# EAGLE design Buggsy Girrafe (EAGLE 7.7.0)
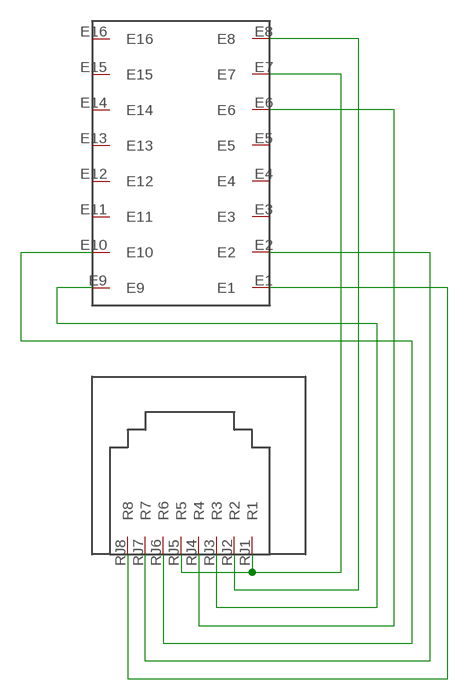
[diagram p0: schematic, sheet 1]

## Parts
U$1  BUGGSY  [RJ45]

## Nets
N$1: U$1.E7 U$1.RJ1(R1) U$1.RJ5(R5)
N$2: U$1.E8 U$1.RJ2(R2)
N$3: U$1.E9 U$1.RJ3(R3)
N$4: U$1.E6 U$1.RJ4(R4)
N$5: U$1.E10 U$1.RJ6(R6)
N$6: U$1.E2 U$1.RJ7(R7)
N$7: U$1.E1 U$1.RJ8(R8)
Unconnected: U$1.E3 U$1.E4 U$1.E5 U$1.E11 U$1.E12 U$1.E13 U$1.E14 U$1.E15 U$1.E16

## Library data of the parts
U$1 = Bugsy:BUGGSY

## Board
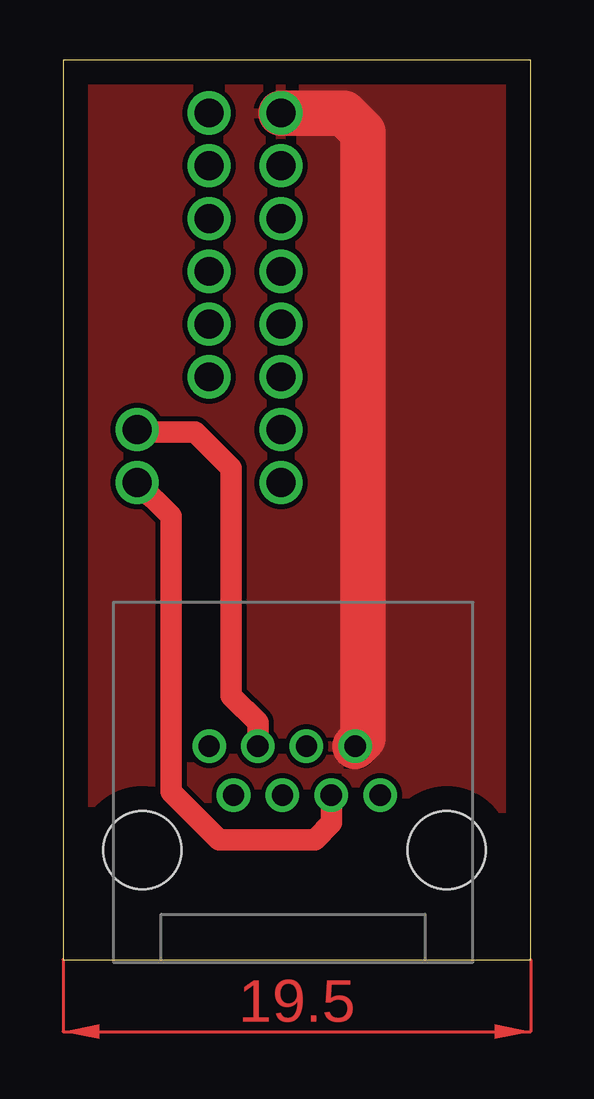
[diagram p1: board, top side]
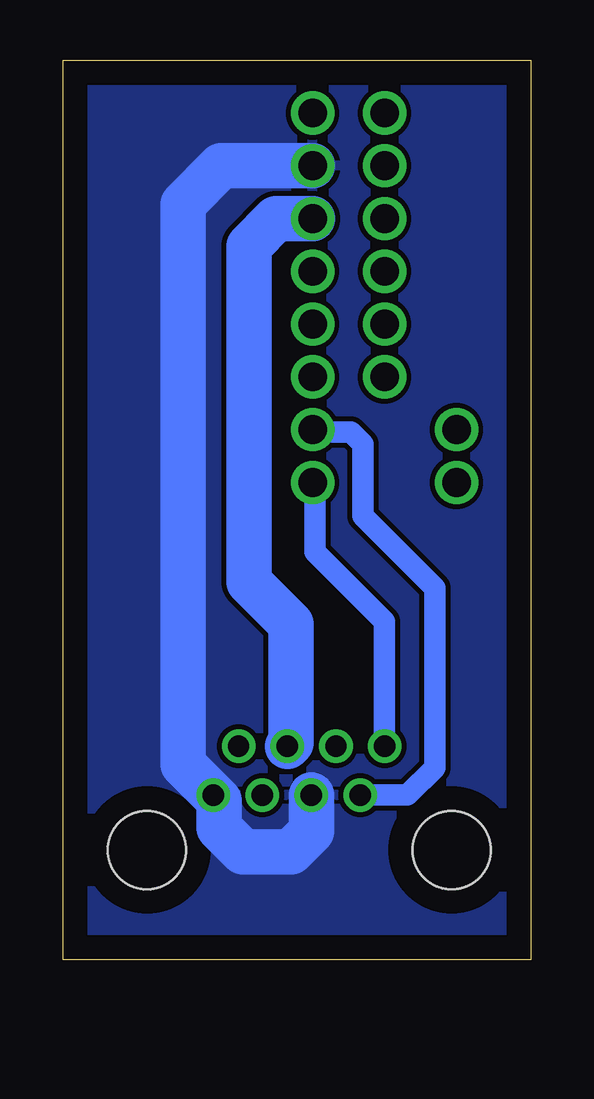
[diagram p2: board, bottom side, seen from below]

Size 19.5 x 37.5 mm. Coordinates in mm from the lower left corner, seen from the top.
Outline: 0,0 19.5,0 19.5,37.5 0,37.5 0,0
Copper layers (1*16): Top 0.035mm / dielectric 1.5mm / Bottom 0.035mm
Design rules "default": minimum track width 10mil, minimum drill 24mil, track to track 8mil, track to pad 8mil, pad to pad 8mil, via to via 8mil, smd to smd 8mil, copper to edge 40mil, drill to drill 8mil, minimum pad ring 10mil, minimum via ring 8mil, stop-mask expansion 4mil, vias tented up to drill 0mil, thermal gap 10mil

### Footprints (pad centres in the part's own frame; a part is rotated, then mirrored left to right if it is on the bottom)
RJ45 = drill 1.2: E1 3,11; E2 3,13.2; E3 3,15.4; E4 3,17.6; E5 3,19.8; E6 3,22; E7 3,24.2; E8 3,26.4; E9 -3,11; E10 -3,13.2; E11 0,15.4; E12 0,17.6; E13 0,19.8; E14 0,22; E15 0,24.2; E16 0,26.4 | drill 0.89: RJ1 7.14,-2.03; RJ2 6.09,0; RJ3 5.1,-2.03; RJ4 4.06,0; RJ5 3.06,-2.03; RJ6 2.03,0; RJ7 1.02,-2.03; RJ8 0,0 | hole 3.25: -2.79,-4.32; 9.91,-4.32

### Placement (x,y rotation side)
U$1  6.09,8.89 0 top

### Tracks (layer width: path | path; a pad name or v marks a point on that pad's centre or on a via)
N$1
  Bottom 1.9: U$1.E7 12.91,33.09 14.5,31.5 14.5,8.13 U$1.RJ1 13,6.63 13,5.5 12,4.5 10,4.5 9.15,5.35 U$1.RJ5
  pour Bottom: 0.5,37 19,37 19,0.5 0.5,0.5
N$2
  Top 1.9: U$1.E8 11.71,35.29 12.5,34.5 12.5,9.21 U$1.RJ2
  pour Top: 0.5,37 19,37 19,0.5 0.5,0.5
N$3
  Top 0.9: U$1.RJ3 11.19,5.69 10.5,5 6.5,5 4.5,7 4.5,18.48 U$1.E9
N$4
  Bottom 1.9: U$1.E6 10.61,30.89 11.75,29.75 11.75,15.75 10,14 10,9.04 U$1.RJ4
N$5
  Top 0.9: U$1.RJ6 8.12,9.88 7,11 7,20.5 5.5,22 3.18,22 U$1.E10
N$6
  Bottom 0.9: U$1.RJ7 5.14,6.86 4,8 4,15.5 7,18.5 7,21.5 7.5,22 9,22 U$1.E2
N$7
  Bottom 0.9: U$1.RJ8 6.09,14.09 9,17 9,19.8 U$1.E1
(copper drawn outside any net)
  shapes: Top area x1